# EAGLE schematic indication (EAGLE 9.5.1)
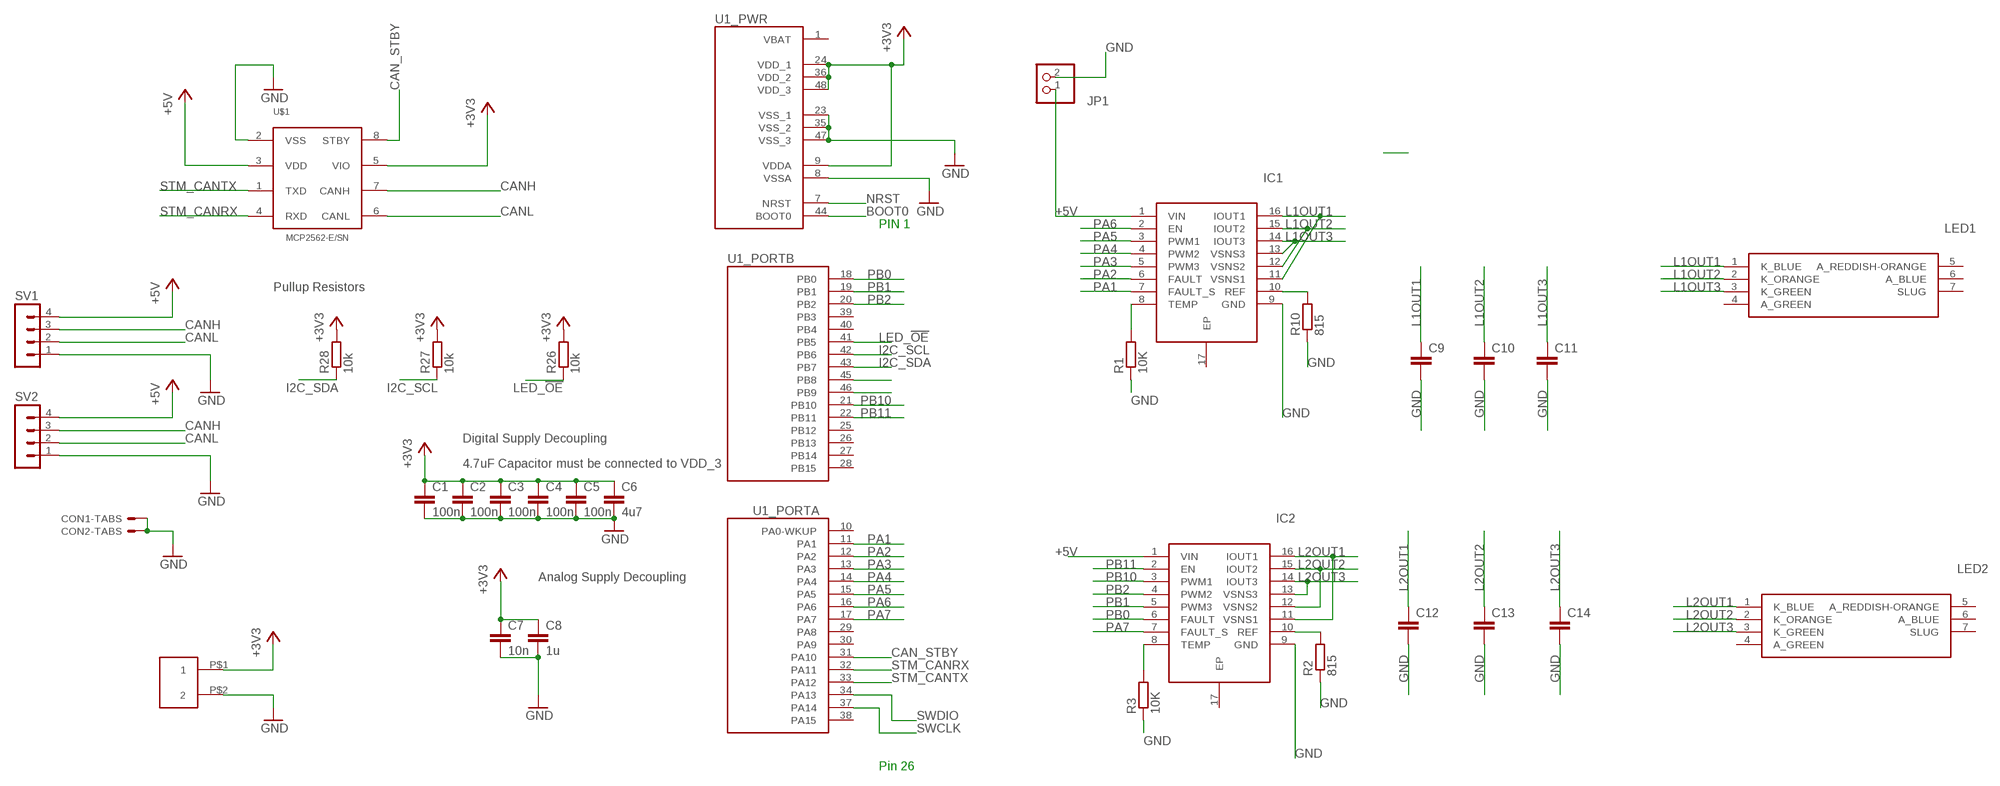
[diagram p0: schematic, sheet 1]

## Parts
C1  100n  C-EUC0805  [C0805]
C2  100n  C-EUC0805  [C0805]
C3  100n  C-EUC0805  [C0805]
C4  100n  C-EUC0805  [C0805]
C5  100n  C-EUC0805  [C0805]
C6  4u7  C-EUC0805  [C0805]
C7  10n  C-EUC0805  [C0805]
C8  1u  C-EUC0805  [C0805]
C9  C-EUC0805  [C0805]
C10  C-EUC0805  [C0805]
C11  C-EUC0805  [C0805]
C12  C-EUC0805  [C0805]
C13  C-EUC0805  [C0805]
C14  C-EUC0805  [C0805]
CON1  SM04B-GHS-TB  [SM04B-GHS-TB]
CON2  SM04B-GHS-TB  [SM04B-GHS-TB]
IC1  TPS92630QPWPRQ1  [SOP65P640X120-17N]
IC2  TPS92630QPWPRQ1  [SOP65P640X120-17N]
JP1  PINHD-1X2  [1X02]
LED1  AAAF5051-05  [AAAF505105]
LED2  AAAF5051-05  [AAAF505105]
R1  10K  R-EU_R0805  [R0805]
R2  815  R-EU_R0805  [R0805]
R3  10K  R-EU_R0805  [R0805]
R10  815  R-EU_R0805  [R0805]
R26  10k  R-EU_R0805  [R0805]
R27  10k  R-EU_R0805  [R0805]
R28  10k  R-EU_R0805  [R0805]
SV1  MA04-1  [MA04-1]
SV2  MA04-1  [MA04-1]
U1  STM32F103CB  [LQFP48]
U$1  MCP2562-E/SN  [SOIC8]
U$4  TE-CONN_5-103669-1  [TE-CONN_5-103669-1]

## Nets
+3V3: C1.1 C2.1 C3.1 C4.1 C5.1 C6.1 C7.1 C8.1 R26.2 R27.2 R28.2 U1.9(_PWR:VDDA) U1.24(_PWR:VDD_1) U1.36(_PWR:VDD_2) U1.48(_PWR:VDD_3) U$1.5(VIO) U$4.P$1
+5V: IC1.1(VIN) IC2.1(VIN) JP1.1 SV1.4 SV2.4 U$1.3(VDD)
BOOT0: U1.44(_PWR:BOOT0)
CAN_STBY: U1.31(_PORTA:PA10) U$1.8(STBY)
CANH: SV1.3 SV2.3 U$1.7(CANH)
CANL: SV1.2 SV2.2 U$1.6(CANL)
GND: C1.2 C2.2 C3.2 C4.2 C5.2 C6.2 C7.2 C8.2 C9.2 C10.2 C11.2 C12.2 C13.2 C14.2 CON1.P$5 CON1.P$6 CON2.P$5 CON2.P$6 IC1.9(GND) IC2.9(GND) JP1.2 R1.1 R2.1 R3.1 R10.1 SV1.1 SV2.1 U1.8(_PWR:VSSA) U1.23(_PWR:VSS_1) U1.35(_PWR:VSS_2) U1.47(_PWR:VSS_3) U$1.2(VSS) U$4.P$2
I2C_SCL: R27.1 U1.42(_PORTB:PB6)
I2C_SDA: R28.1 U1.43(_PORTB:PB7)
L1OUT1: C9.1 IC1.11(VSNS1) IC1.16(IOUT1) LED1.1(K_BLUE)
L1OUT2: C10.1 IC1.12(VSNS2) IC1.15(IOUT2) LED1.2(K_ORANGE)
L1OUT3: C11.1 IC1.13(VSNS3) IC1.14(IOUT3) LED1.3(K_GREEN)
L2OUT1: C12.1 IC2.11(VSNS1) IC2.16(IOUT1) LED2.1(K_BLUE)
L2OUT2: C13.1 IC2.12(VSNS2) IC2.15(IOUT2) LED2.2(K_ORANGE)
L2OUT3: C14.1 IC2.13(VSNS3) IC2.14(IOUT3) LED2.3(K_GREEN)
LED_!OE: R26.1 U1.41(_PORTB:PB5)
N$1: IC1.10(REF) R10.2
N$2: IC2.8(TEMP) R3.2
N$3: IC2.10(REF) R2.2
N$12: IC1.8(TEMP) R1.2
N$14: U1.46(_PORTB:PB9)
NRST: U1.7(_PWR:NRST)
PA1: IC1.7(FAULT_S) U1.11(_PORTA:PA1)
PA2: IC1.6(FAULT) U1.12(_PORTA:PA2)
PA3: IC1.5(PWM3) U1.13(_PORTA:PA3)
PA4: IC1.4(PWM2) U1.14(_PORTA:PA4)
PA5: IC1.3(PWM1) U1.15(_PORTA:PA5)
PA6: IC1.2(EN) U1.16(_PORTA:PA6)
PA7: IC2.7(FAULT_S) U1.17(_PORTA:PA7)
PB0: IC2.6(FAULT) U1.18(_PORTB:PB0)
PB1: IC2.5(PWM3) U1.19(_PORTB:PB1)
PB2: IC2.4(PWM2) U1.20(_PORTB:PB2)
PB8: U1.45(_PORTB:PB8)
PB10: IC2.3(PWM1) U1.21(_PORTB:PB10)
PB11: IC2.2(EN) U1.22(_PORTB:PB11)
STM_CANRX: U1.32(_PORTA:PA11) U$1.4(RXD)
STM_CANTX: U1.33(_PORTA:PA12) U$1.1(TXD)
SWCLK: U1.37(_PORTA:PA14)
SWDIO: U1.34(_PORTA:PA13)
Unconnected: CON1.P$1 CON1.P$2 CON1.P$3 CON1.P$4 CON2.P$1 CON2.P$2 CON2.P$3 CON2.P$4 IC1.17(EP) IC2.17(EP) LED1.4(A_GREEN) LED1.5(A_REDDISH-ORANGE) LED1.6(A_BLUE) LED1.7(SLUG) LED2.4(A_GREEN) LED2.5(A_REDDISH-ORANGE) LED2.6(A_BLUE) LED2.7(SLUG) U1.1(_PWR:VBAT) U1.2(_PORTC-D:PC13-TAMPER-RTC) U1.3(_PORTC-D:PC14-OSC32_IN) U1.4(_PORTC-D:PC15-OSC32_OUT) U1.5(_PORTC-D:PD0-OSC_IN) U1.6(_PORTC-D:PD1-OSC_OUT) U1.10(_PORTA:PA0-WKUP) U1.25(_PORTB:PB12) U1.26(_PORTB:PB13) U1.27(_PORTB:PB14) U1.28(_PORTB:PB15) U1.29(_PORTA:PA8) U1.30(_PORTA:PA9) U1.38(_PORTA:PA15) U1.39(_PORTB:PB3) U1.40(_PORTB:PB4)

## Notes on the sheet
- PIN 1
- Pullup Resistors
- Digital Supply Decoupling
- 4.7uF Capacitor must be connected to VDD_3
- Analog Supply Decoupling
- Pin 26

## Library data of the parts
C1-C8 = resistor:C-EU: CAPACITOR, European symbol
C9-C14 = rcl:C-EU: CAPACITOR, European symbol; SPICEPREFIX: C
CON1 CON2 = ARVP:SM04B-GHS-TB
IC1 IC2 = TPS92630QPWPRQ1:TPS92630QPWPRQ1: Automotive Three-Channel Linear LED Driver with Analog and PWM Dimming Source: Datasheet <http://www.ti.com/lit/gpn/tps92630-q1>; DESCRIPTION: Automotive Three-Channel Linear LED Driver with Analog and PWM Dimming; HEIGHT: 1.2mm; MANUFACTURER_NAME: Texas Instruments; MANUFACTURER_PART_NUMBER: TPS92630QPWPRQ1; MOUSER_PART_NUMBER: 595-TPS92630QPWPRQ1; MOUSER_PRICE-STOCK: https://www.mouser.com/Search/Refine.aspx?Keyword=595-TPS92630QPWPRQ1
JP1 = pinhead:PINHD-1X2: PIN HEADER
LED1 LED2 = AAAF5051-05:AAAF5051-05: High Power LEDs - Multi-Color 5x5mm FULL COLOR SMD LED LAMP Source: Datasheet <http://www.kingbrightusa.com/images/catalog/SPEC/AAAF5051-05.pdf>; DESCRIPTION: High Power LEDs - Multi-Color 5x5mm FULL COLOR SMD LED LAMP; HEIGHT: 1.4mm; MANUFACTURER_NAME: Kingbright; MANUFACTURER_PART_NUMBER: AAAF5051-05; MOUSER_PART_NUMBER: 604-AAAF5051-05; MOUSER_PRICE-STOCK: https://www.mouser.com/Search/Refine.aspx?Keyword=604-AAAF5051-05
R1-R3 R10 R26-R28 = resistor:R-EU_: RESISTOR, European symbol
SV1 SV2 = con-lstb:MA04-1: PIN HEADER; OC_FARNELL: unknown; OC_NEWARK: unknown
U1 = SPEAR:STM32F103CB
U$1 = SPEAR:MCP2562-E/SN
U$4 = SPEAR:TE-CONN_5-103669-1